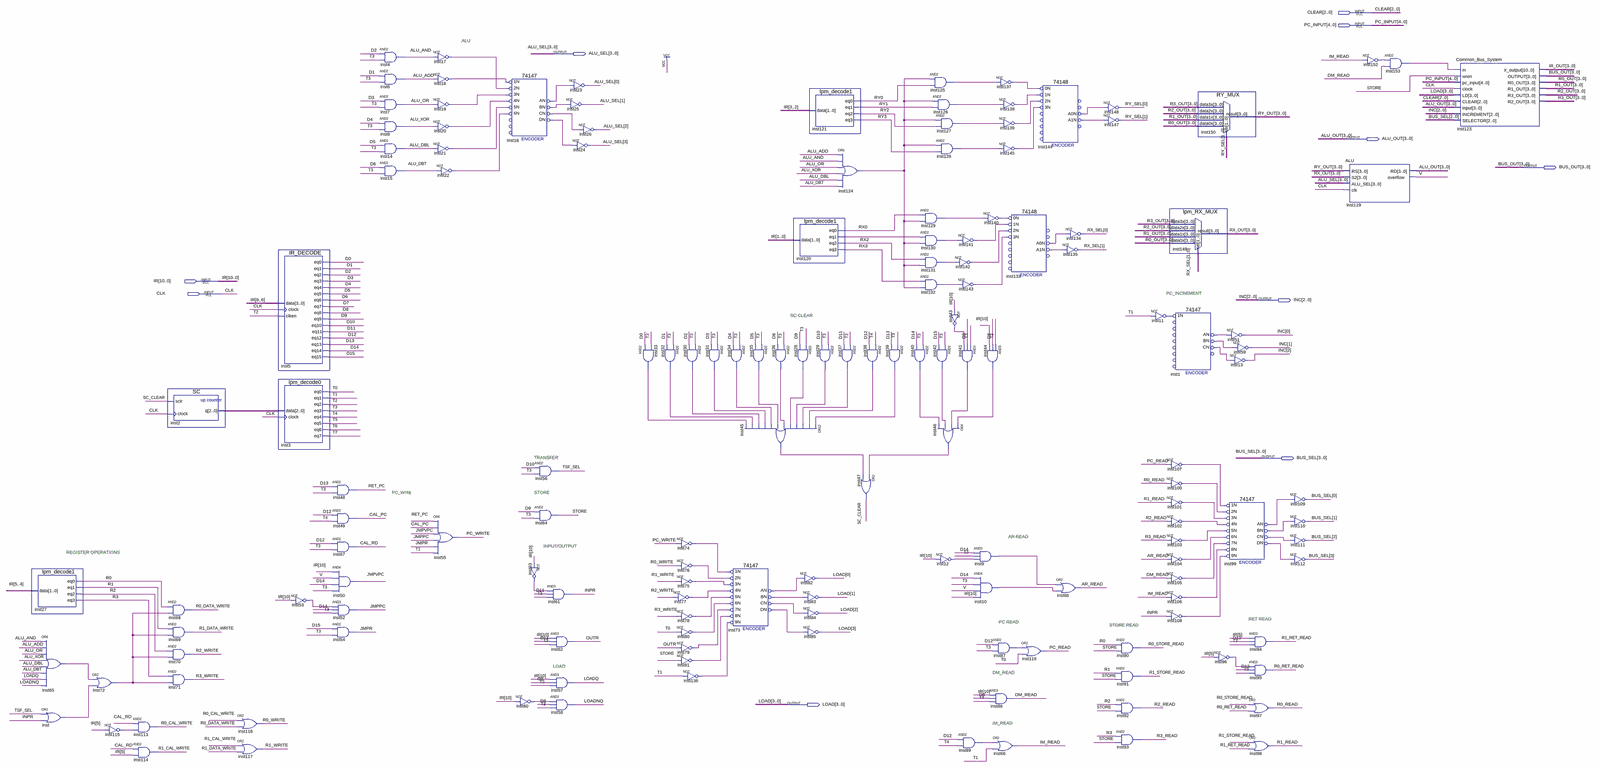
[diagram p0: schematic sheet, whole]
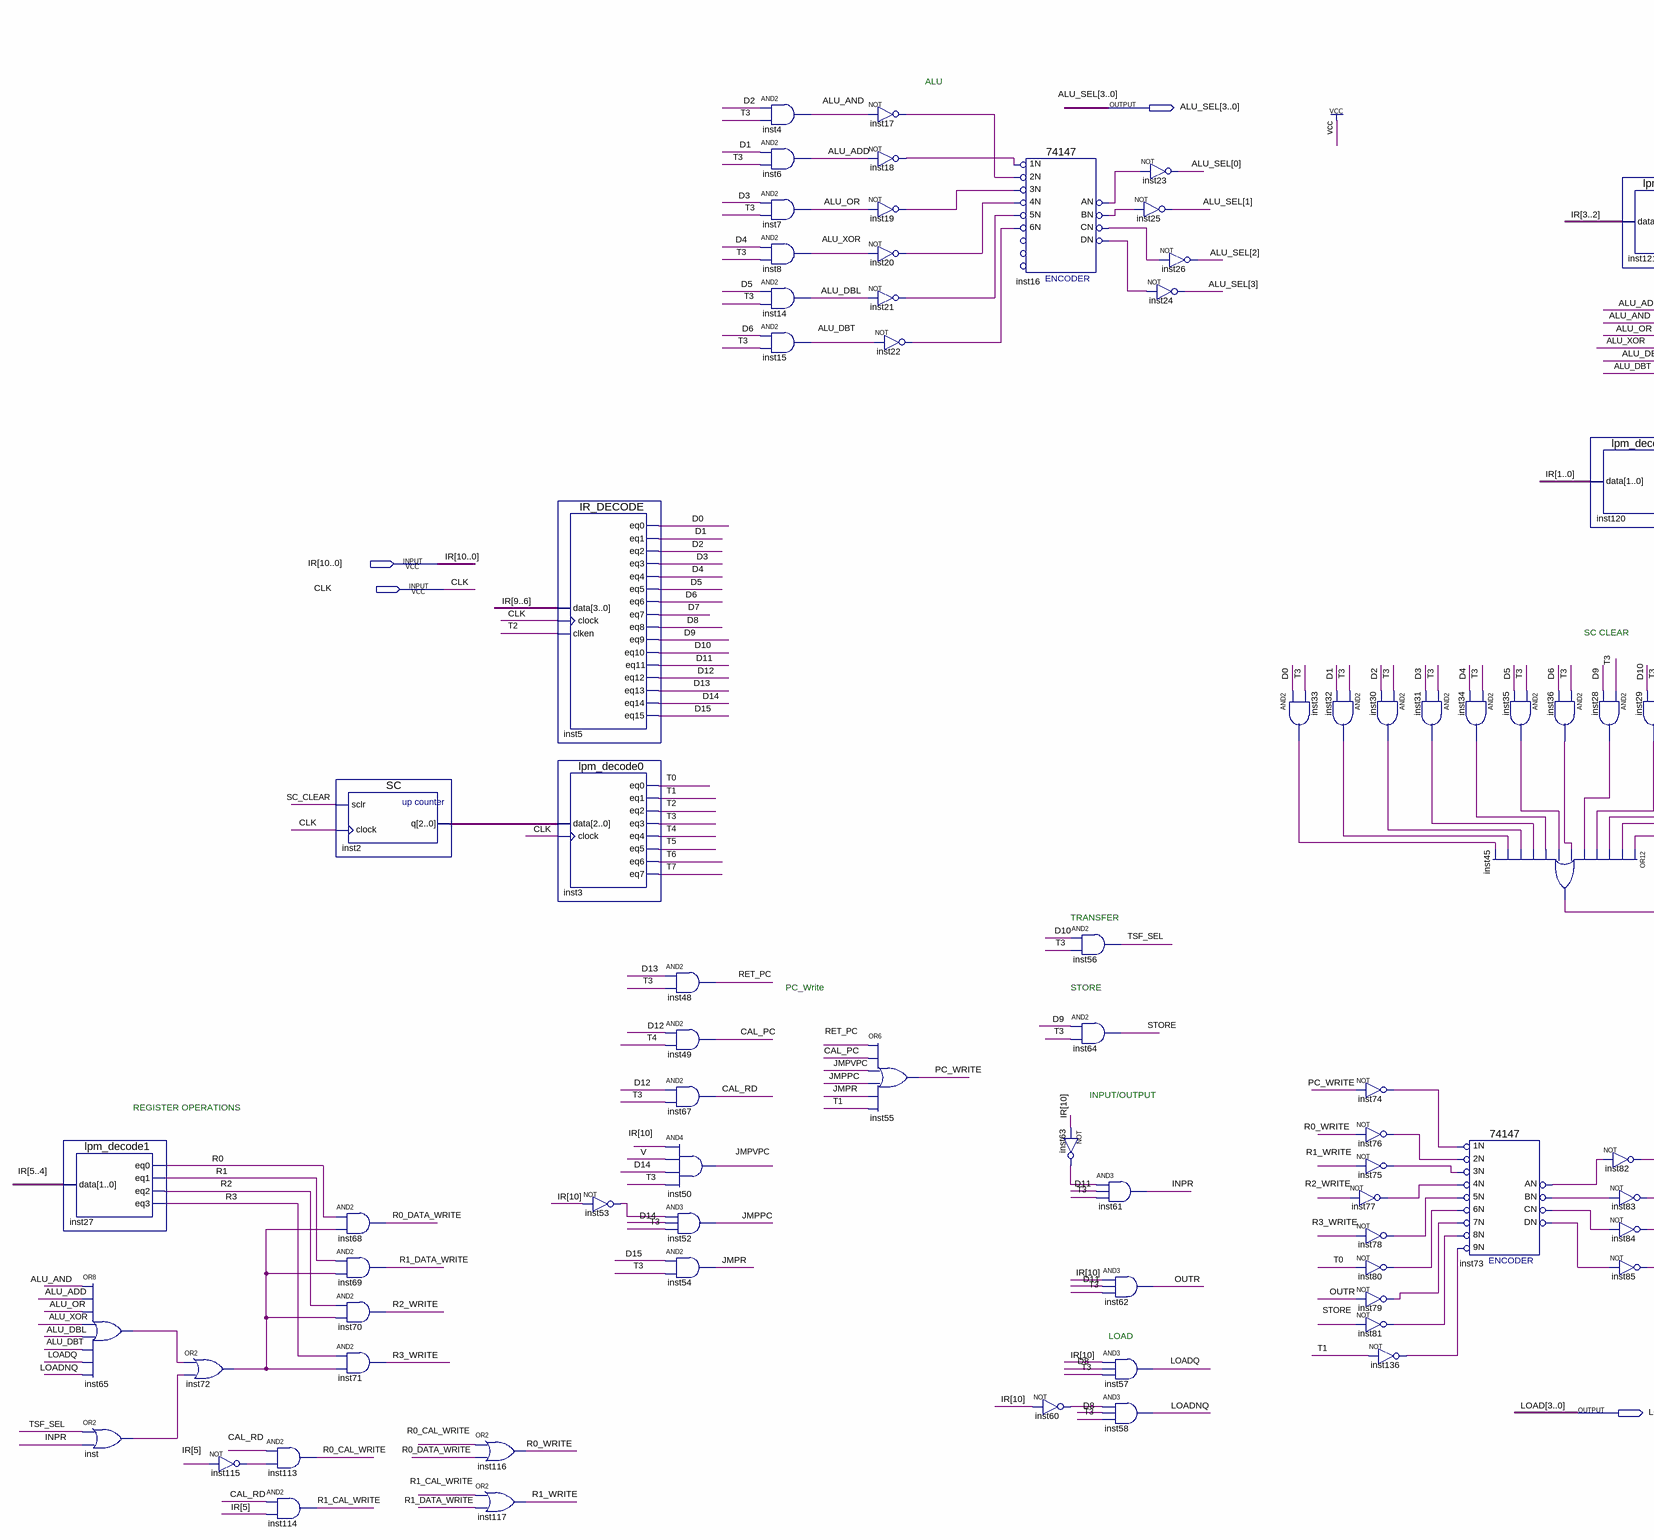
[diagram p1: schematic sheet, left part]
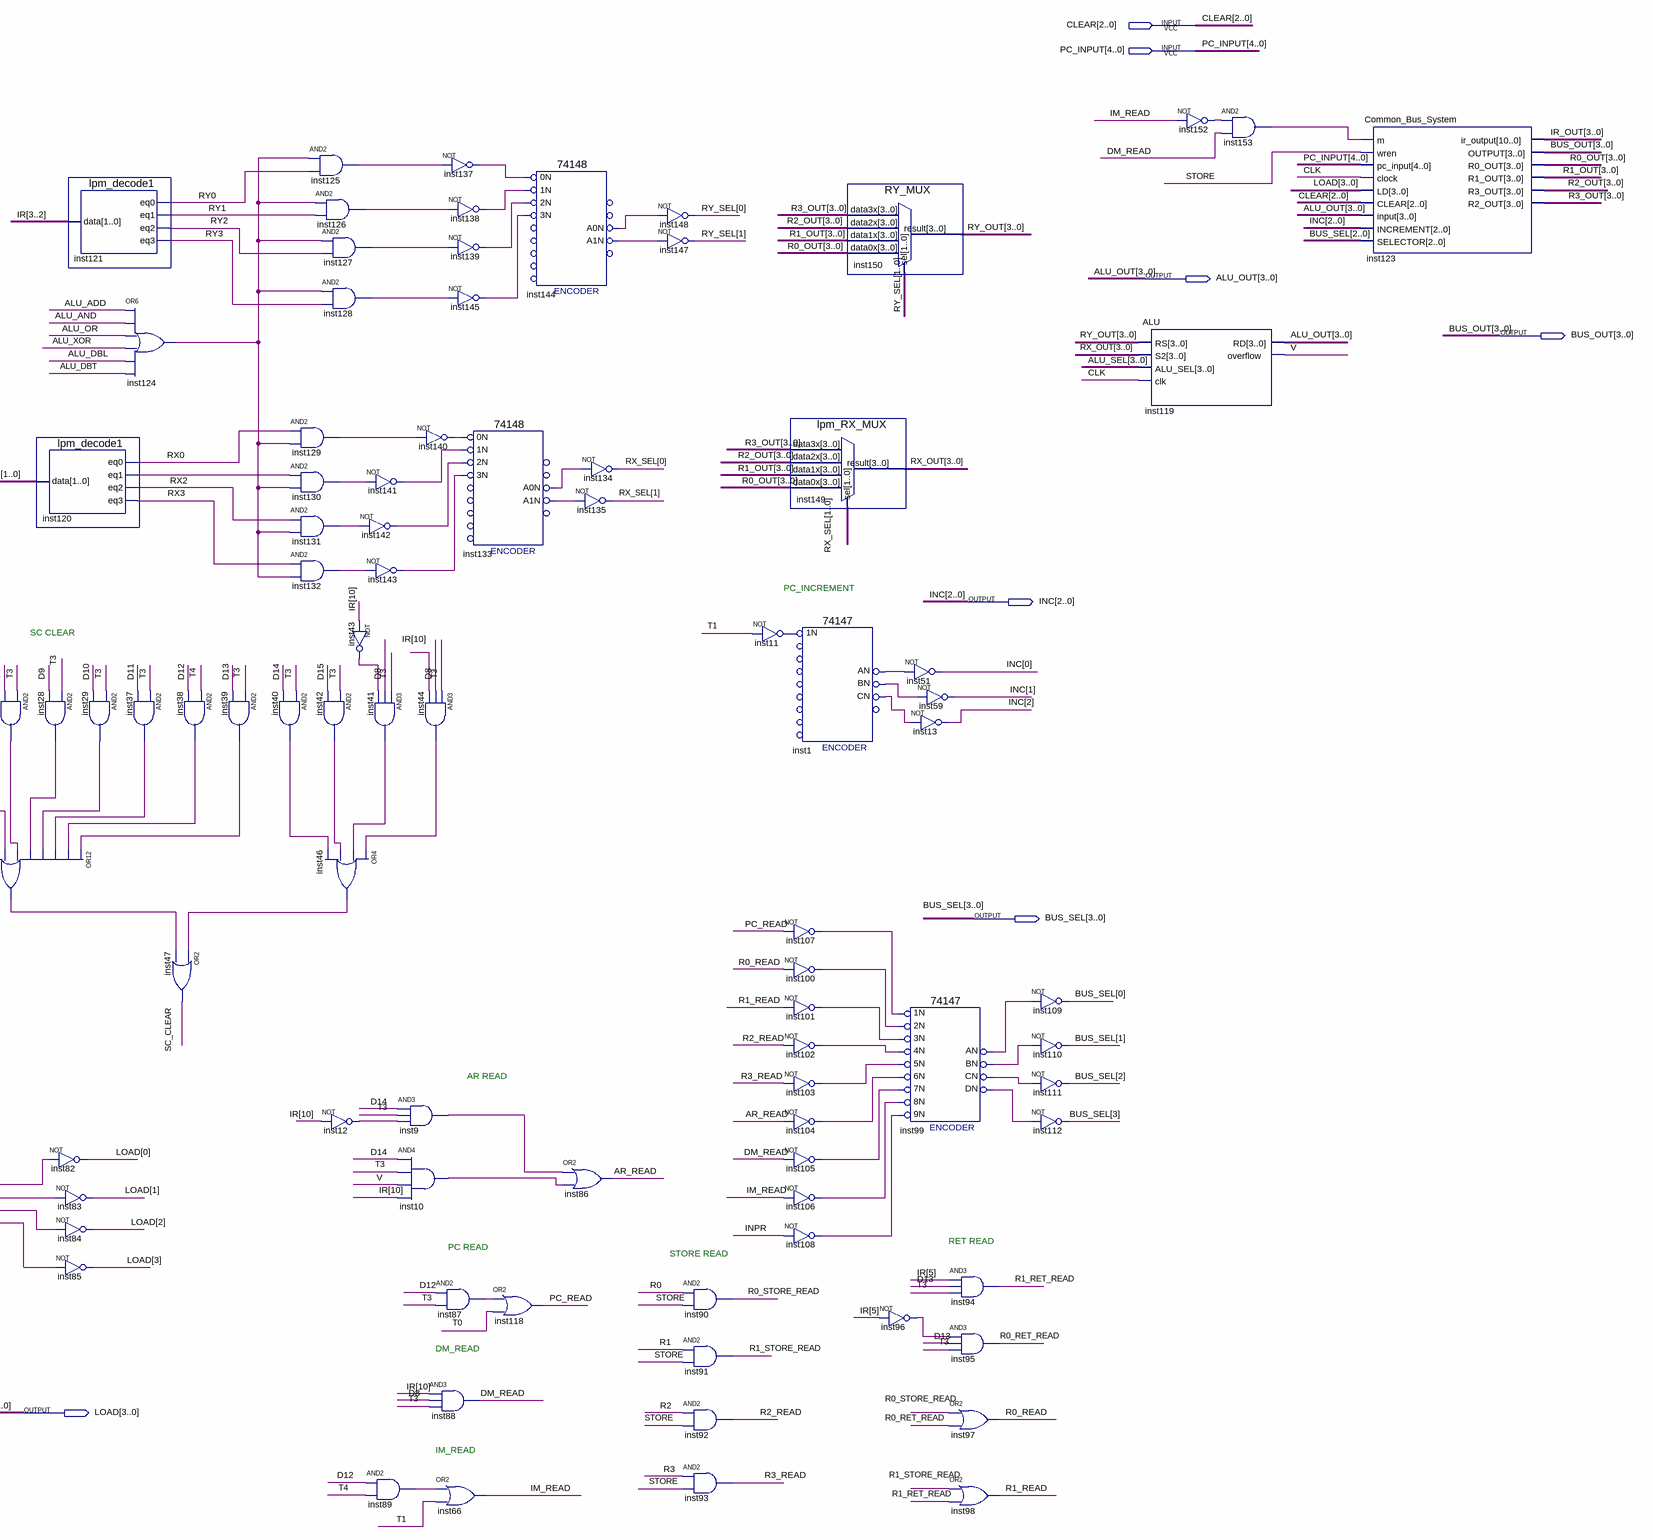
[diagram p2: schematic sheet, right part]
// Quartus schematic Control_Unit.bdf as structural Verilog: 151 symbols, 10 pins
module Control_Unit (
  input  [2:0] CLEAR,
  input  [4:0] PC_INPUT,
  input  [10:0] IR,
  input  CLK,
  output [3:0] ALU_SEL,
  output [3:0] ALU_OUT,
  output [3:0] BUS_OUT,
  output [2:0] INC,
  output [3:0] BUS_SEL,
  output [3:0] LOAD
);

  wire ALU_ADD, ALU_AND, ALU_DBL, ALU_DBT, ALU_OR, ALU_XOR, AR_READ, CAL_PC, CAL_RD, D0, D1, D2, D3, D4, D5,
       D6, D7, D8, D9, D10, D11, D12, D13, D14, D15, DM_READ, IM_READ, INPR, inst1_an, inst1_bn, inst1_cn,
       inst9_out, inst10_out, inst11_out, inst12_out, inst16_an, inst16_bn, inst16_cn, inst16_dn, inst17_out,
       inst18_out, inst19_out, inst20_out, inst21_out, inst22_out, inst28_out, inst29_out, inst30_out,
       inst31_out, inst32_out, inst33_out, inst34_out, inst35_out, inst36_out, inst37_out, inst38_out,
       inst39_out, inst40_out, inst41_out, inst42_out, inst43_out, inst44_out, inst45_out, inst46_out,
       inst53_out, inst60_out, inst63_out, inst65_out, inst72_out, inst73_an, inst73_bn, inst73_cn,
       inst73_dn, inst74_out, inst75_out, inst76_out, inst77_out, inst78_out, inst79_out, inst80_out,
       inst81_out, inst87_out, inst89_out, inst96_out, inst99_an, inst99_bn, inst99_cn, inst99_dn,
       inst100_out, inst101_out, inst102_out, inst103_out, inst104_out, inst105_out, inst106_out,
       inst107_out, inst108_out, inst115_out, inst120_eq1, inst124_out, inst125_out, inst126_out,
       inst127_out, inst128_out, inst129_out, inst130_out, inst131_out, inst132_out, inst133_a0n,
       inst133_a1n, inst136_out, inst137_out, inst138_out, inst139_out, inst140_out, inst141_out,
       inst142_out, inst143_out, inst144_a0n, inst144_a1n, inst145_out, inst152_out, inst153_out, inst_out,
       JMPPC, JMPR, JMPVPC, LOADNQ, LOADQ, OUTR, PC_READ, PC_WRITE, R0, R0_CAL_WRITE, R0_DATA_WRITE, R0_READ,
       R0_RET_READ, R0_STORE_READ, R0_WRITE, R1, R1_CAL_WRITE, R1_DATA_WRITE, R1_READ, R1_RET_READ,
       R1_STORE_READ, R1_WRITE, R2, R2_READ, R2_WRITE, R3, R3_READ, R3_WRITE, RET_PC, RX0, RX2, RX3, RY0,
       RY1, RY2, RY3, SC_CLEAR, STORE, T0, T1, T2, T3, T4, T5, T6, T7, TSF_SEL, V;
  wire [1:0] RX_SEL, RY_SEL;
  wire [2:0] inst2_q;
  wire [3:0] IR_OUT, R0_OUT, R1_OUT, R2_OUT, R3_OUT, RX_OUT, RY_OUT;

  lpm_decode1 inst27 (.data(IR[5:4]), .eq0(R0), .eq1(R1), .eq2(R2), .eq3(R3));
  or inst65 (inst65_out, ALU_AND, ALU_ADD, ALU_OR, ALU_XOR, ALU_DBL, ALU_DBT, LOADQ, LOADNQ);
  or inst (inst_out, TSF_SEL, INPR);
  or inst72 (inst72_out, inst65_out, inst_out);
  not inst115 (inst115_out, IR[5]);
  and inst113 (R0_CAL_WRITE, CAL_RD, inst115_out);
  and inst114 (R1_CAL_WRITE, CAL_RD, IR[5]);
  SC inst2 (.sclr(SC_CLEAR), .clock(CLK), .q(inst2_q));
  and inst68 (R0_DATA_WRITE, R0, inst72_out);
  and inst69 (R1_DATA_WRITE, R1, inst72_out);
  and inst70 (R2_WRITE, R2, inst72_out);
  and inst71 (R3_WRITE, R3, inst72_out);
  or inst116 (R0_WRITE, R0_CAL_WRITE, R0_DATA_WRITE);
  or inst117 (R1_WRITE, R1_CAL_WRITE, R1_DATA_WRITE);
  IR_DECODE inst5 (
    .data(IR[9:6]), .clock(CLK), .clken(T2), .eq0(D0), .eq1(D1), .eq2(D2), .eq3(D3), .eq4(D4), .eq5(D5),
    .eq6(D6), .eq7(D7), .eq8(D8), .eq9(D9), .eq10(D10), .eq11(D11), .eq12(D12), .eq13(D13), .eq14(D14),
    .eq15(D15));
  lpm_decode0 inst3 (
    .data(inst2_q), .clock(CLK), .eq0(T0), .eq1(T1), .eq2(T2), .eq3(T3), .eq4(T4), .eq5(T5), .eq6(T6),
    .eq7(T7));
  not inst53 (inst53_out, IR[10]);
  and inst48 (RET_PC, D13, T3);
  and inst49 (CAL_PC, D12, T4);
  and inst67 (CAL_RD, D12, T3);
  and inst50 (JMPVPC, IR[10], V, D14, T3);
  and inst52 (JMPPC, inst53_out, D14, T3);
  and inst54 (JMPR, D15, T3);
  and inst4 (ALU_AND, D2, T3);
  and inst6 (ALU_ADD, D1, T3);
  and inst7 (ALU_OR, D3, T3);
  and inst8 (ALU_XOR, D4, T3);
  and inst14 (ALU_DBL, D5, T3);
  and inst15 (ALU_DBT, D6, T3);
  not inst17 (inst17_out, ALU_AND);
  not inst18 (inst18_out, ALU_ADD);
  not inst19 (inst19_out, ALU_OR);
  not inst20 (inst20_out, ALU_XOR);
  not inst21 (inst21_out, ALU_DBL);
  not inst22 (inst22_out, ALU_DBT);
  or inst55 (PC_WRITE, RET_PC, CAL_PC, JMPVPC, JMPPC, JMPR, T1);
  \74147  inst16 (
    .\1N (inst18_out), .\2N (inst17_out), .\3N (inst19_out), .\4N (inst20_out), .\5N (inst21_out),
    .\6N (inst22_out), .AN(inst16_an), .BN(inst16_bn), .CN(inst16_cn), .DN(inst16_dn));
  not inst60 (inst60_out, IR[10]);
  and inst56 (TSF_SEL, D10, T3);
  and inst64 (STORE, D9, T3);
  not inst63 (inst63_out, IR[10]);
  and inst61 (INPR, inst63_out, D11, T3);
  not inst23 (ALU_SEL[0], inst16_an);
  not inst25 (ALU_SEL[1], inst16_bn);
  not inst24 (ALU_SEL[3], inst16_dn);
  and inst62 (OUTR, IR[10], D11, T3);
  and inst57 (LOADQ, IR[10], D8, T3);
  and inst58 (LOADNQ, inst60_out, D8, T3);
  not inst26 (ALU_SEL[2], inst16_cn);
  and inst33 (inst33_out, D0, T3);
  and inst32 (inst32_out, T3, D1);
  not inst77 (inst77_out, R2_WRITE);
  and inst30 (inst30_out, T3, D2);
  not inst74 (inst74_out, PC_WRITE);
  not inst76 (inst76_out, R0_WRITE);
  not inst75 (inst75_out, R1_WRITE);
  not inst78 (inst78_out, R3_WRITE);
  not inst80 (inst80_out, T0);
  not inst79 (inst79_out, OUTR);
  not inst81 (inst81_out, STORE);
  not inst136 (inst136_out, T1);
  and inst31 (inst31_out, T3, D3);
  and inst35 (inst35_out, T3, D5);
  and inst34 (inst34_out, T3, D4);
  or inst45 (inst45_out, inst39_out, inst38_out, inst37_out, inst29_out, inst28_out, inst36_out, inst35_out, inst34_out, inst31_out, inst30_out, inst32_out, inst33_out);
  \74147  inst73 (
    .\1N (inst74_out), .\2N (inst76_out), .\3N (inst75_out), .\4N (inst77_out), .\5N (inst78_out),
    .\6N (inst80_out), .\7N (inst79_out), .\8N (inst81_out), .\9N (inst136_out), .AN(inst73_an),
    .BN(inst73_bn), .CN(inst73_cn), .DN(inst73_dn));
  and inst36 (inst36_out, T3, D6);
  lpm_decode1 inst120 (.data(IR[1:0]), .eq0(RX0), .eq1(inst120_eq1), .eq2(RX2), .eq3(RX3));
  and inst28 (inst28_out, T3, D9);
  not inst82 (LOAD[0], inst73_an);
  lpm_decode1 inst121 (.data(IR[3:2]), .eq0(RY0), .eq1(RY1), .eq2(RY2), .eq3(RY3));
  and inst29 (inst29_out, T3, D10);
  not inst83 (LOAD[1], inst73_bn);
  not inst84 (LOAD[2], inst73_cn);
  not inst85 (LOAD[3], inst73_dn);
  or inst124 (inst124_out, ALU_ADD, ALU_AND, ALU_OR, ALU_XOR, ALU_DBL, ALU_DBT);
  and inst37 (inst37_out, T3, D11);
  and inst38 (inst38_out, T4, D12);
  or inst47 (SC_CLEAR, inst46_out, inst45_out);
  and inst39 (inst39_out, T3, D13);
  and inst129 (inst129_out, RX0, inst124_out);
  and inst130 (inst130_out, inst120_eq1, inst124_out);
  and inst131 (inst131_out, RX2, inst124_out);
  and inst132 (inst132_out, RX3, inst124_out);
  and inst40 (inst40_out, T3, D14);
  and inst125 (inst125_out, inst124_out, RY0);
  and inst126 (inst126_out, inst124_out, RY1);
  and inst127 (inst127_out, inst124_out, RY2);
  and inst128 (inst128_out, inst124_out, RY3);
  not inst43 (inst43_out, IR[10]);
  and inst42 (inst42_out, T3, D15);
  or inst46 (inst46_out, inst44_out, inst41_out, inst42_out, inst40_out);
  not inst12 (inst12_out, IR[10]);
  not inst141 (inst141_out, inst130_out);
  not inst142 (inst142_out, inst131_out);
  not inst143 (inst143_out, inst132_out);
  and inst41 (inst41_out, T3, D8, inst43_out);
  and inst9 (inst9_out, D14, T3, inst12_out);
  and inst10 (inst10_out, D14, T3, V, IR[10]);
  and inst89 (inst89_out, D12, T4);
  not inst137 (inst137_out, inst125_out);
  not inst138 (inst138_out, inst126_out);
  not inst139 (inst139_out, inst127_out);
  not inst145 (inst145_out, inst128_out);
  not inst140 (inst140_out, inst129_out);
  and inst44 (inst44_out, T3, D8, IR[10]);
  and inst87 (inst87_out, D12, T3);
  and inst88 (DM_READ, IR[10], D8, T3);
  or inst66 (IM_READ, inst89_out, T1);
  \74148  inst133 (
    .\0N (inst140_out), .\1N (inst141_out), .\2N (inst142_out), .\3N (inst143_out), .A0N(inst133_a0n),
    .A1N(inst133_a1n));
  or inst118 (PC_READ, inst87_out, T0);
  \74148  inst144 (
    .\0N (inst137_out), .\1N (inst138_out), .\2N (inst139_out), .\3N (inst145_out), .A0N(inst144_a0n),
    .A1N(inst144_a1n));
  not inst134 (RX_SEL[0], inst133_a0n);
  not inst135 (RX_SEL[1], inst133_a1n);
  or inst86 (AR_READ, inst9_out, inst10_out);
  not inst148 (RY_SEL[0], inst144_a0n);
  not inst147 (RY_SEL[1], inst144_a1n);
  and inst90 (R0_STORE_READ, R0, STORE);
  and inst91 (R1_STORE_READ, R1, STORE);
  and inst92 (R2_READ, R2, STORE);
  and inst93 (R3_READ, R3, STORE);
  not inst11 (inst11_out, T1);
  lpm_RX_MUX inst149 (
    .data3x(R3_OUT), .data2x(R2_OUT), .data1x(R1_OUT), .data0x(R0_OUT), .sel(RX_SEL), .result(RX_OUT));
  \74147  inst1 (.\1N (inst11_out), .AN(inst1_an), .BN(inst1_bn), .CN(inst1_cn));
  not inst107 (inst107_out, PC_READ);
  not inst100 (inst100_out, R0_READ);
  not inst101 (inst101_out, R1_READ);
  not inst102 (inst102_out, R2_READ);
  not inst103 (inst103_out, R3_READ);
  not inst104 (inst104_out, AR_READ);
  not inst105 (inst105_out, DM_READ);
  not inst106 (inst106_out, IM_READ);
  not inst108 (inst108_out, INPR);
  RY_MUX inst150 (.data3x(R3_OUT), .data2x(R2_OUT), .data1x(R1_OUT), .data0x(R0_OUT), .sel(RY_SEL), .result(RY_OUT));
  not inst51 (INC[0], inst1_an);
  not inst13 (INC[2], inst1_cn);
  \74147  inst99 (
    .\1N (inst107_out), .\2N (inst100_out), .\3N (inst101_out), .\6N (inst104_out), .\5N (inst103_out),
    .\4N (inst102_out), .\9N (inst108_out), .\8N (inst106_out), .\7N (inst105_out), .CN(inst99_cn),
    .BN(inst99_bn), .AN(inst99_an), .DN(inst99_dn));
  not inst96 (inst96_out, IR[5]);
  not inst59 (INC[1], inst1_bn);
  and inst94 (R1_RET_READ, IR[5], D13, T3);
  and inst95 (R0_RET_READ, inst96_out, D13, T3);
  or inst97 (R0_READ, R0_STORE_READ, R0_RET_READ);
  or inst98 (R1_READ, R1_STORE_READ, R1_RET_READ);
  not inst109 (BUS_SEL[0], inst99_an);
  not inst110 (BUS_SEL[1], inst99_bn);
  not inst111 (BUS_SEL[2], inst99_cn);
  not inst112 (BUS_SEL[3], inst99_dn);
  ALU inst119 (.RS(RY_OUT), .S2(RX_OUT), .ALU_SEL(ALU_SEL), .clk(CLK), .RD(ALU_OUT), .overflow(V));
  not inst152 (inst152_out, IM_READ);
  and inst153 (inst153_out, inst152_out, DM_READ);
  Common_Bus_System inst123 (
    .m(inst153_out), .wren(STORE), .pc_input(PC_INPUT), .clock(CLK), .LD(LOAD), .CLEAR(CLEAR),
    .\input (ALU_OUT), .INCREMENT(INC), .SELECTOR(BUS_SEL[2:0]), .ir_output(IR_OUT), .OUTPUT(BUS_OUT),
    .R0_OUT(R0_OUT), .R1_OUT(R1_OUT), .R3_OUT(R2_OUT), .R2_OUT(R3_OUT));

  // Notes on the sheet:
  //   ALU
  //   PC_INCREMENT
  //   SC CLEAR
  //   TRANSFER
  //   PC_Write
  //   STORE
  //   AR READ
  //   INPUT/OUTPUT
  //   REGISTER OPERATIONS
  //   RET READ
  //   PC READ
  //   STORE READ
  //   LOAD
  //   DM_READ
  //   IM_READ
endmodule
